# Altium schematic sheet TPS5420_SMPS.SchDoc
size A4
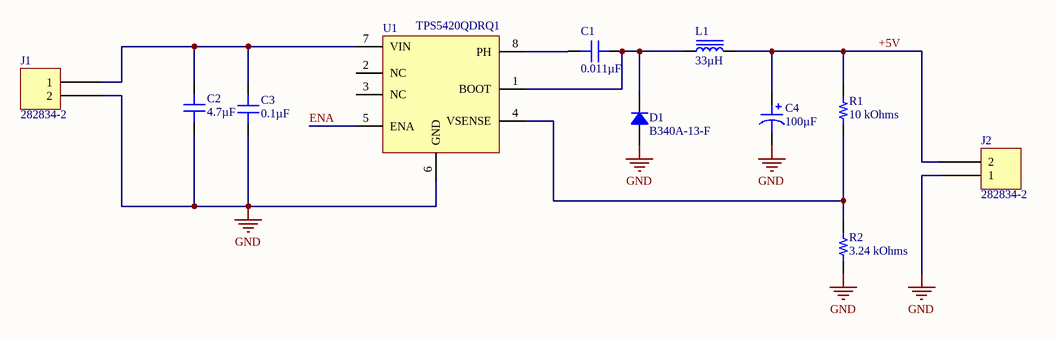
[diagram p0: TPS5420_SMPS.SchDoc]

## Parts
C1  0.011µF  [CAP 0805_2012]
C2  4.7µF  [CAP 0805_2012]
C3  0.1µF  [CAP 0805_2012]
C4  100µF  [CAP ALSMD 6.6MM H6.1MM]
D1  B340A-13-F  [DO214AC SMA]
J1  282834-2  [TE 282834-2]
J2  282834-2  [TE 282834-2]
L1  33µH  [BOURNS SRN8040]
R1  10 kOhms  [RES 0805_2012]
R2  3.24 kOhms  [RES 0805_2012]
U1  TPS5420QDRQ1  [SO8]

## Nets
GND: C2.1 C3.1 C4.2 D1.1 J1.2 J2.1 R2.1 U1.6(GND)
+5V: C4.1 J2.2 L1.2 R1.2
ENA: U1.5(ENA)
NetC1_1: C1.1 U1.8(PH)
NetC1_2: C1.2 D1.2 L1.1 U1.1(BOOT)
NetC2_2: C2.2 C3.2 J1.1 U1.7(VIN)
NetR1_1: R1.1 R2.2 U1.4(VSENSE)

Not connected (* = marked no-connect by the designer): U1 2(NC) 3(NC)

## Library data of the parts
C1 = GRM2195C1H113JA01D: CAP CER 0.011UF 50V C0G/NP0 0805; Manufacturer: Murata Electronics; Temperature Coefficient: C0G, NP0; Tolerance: ±5%; Part Number: GRM2195C1H113JA01D; Value: 0.011µF; Applications: General Purpose; Capacitance: 0.011µF; ComponentLink1Description: Datasheet; ComponentLink1URL: https://www.murata.com/~/media/webrenewal/support/library/catalog/products/capacitor/mlcc/c02e.ashx?la=en-us; ComponentLink2Description: DigiKey Link; ComponentLink2URL: http://digikey.com/product-detail/en/murata-electronics/GRM2195C1H113JA01D/490-8297-1-ND/4380591; Device Package: 0805 (2012 Metric); LastUpdated: 2.09.2020 01:04:18; Lifecycle Status: Active; Minimum Order: 1; Mounting Type: Surface Mount, MLCC; Operating Temperature: -55°C ~ 125°C; Package / Case: 0805 (2012 Metric); Packaging: TapeAndReel; PartId: 14729; Part Status: Active; Price: 0.09; Series: GRM; Size / Dimension: 0.079" L x 0.049" W (2.00mm x 1.25mm); Supplier 1: DigiKey; Supplier Part Number 1: 490-8297-1-ND; Thickness (Max): 0.037" (0.95mm); Voltage - Rated: 50V
C2 = C2012X5R1V475K125AC: CAP CER 4.7UF 35V X5R 0805; Manufacturer: TDK Corporation; Tolerance: ±10%; Part Number: C2012X5R1V475K125AC; Value: 4.7µF; Applications: General Purpose; Capacitance: 4.7µF; ComponentLink1Description: Datasheet; ComponentLink1URL: https://product.tdk.com/info/en/catalog/datasheets/mlcc_commercial_general_en.pdf?ref_disty=digikey; ComponentLink2Description: DigiKey Link; ComponentLink2URL: http://digikey.com/product-detail/en/tdk-corporation/C2012X5R1V475K125AC/445-14431-1-ND/3956097; Device Package: 0805 (2012 Metric); Features: Low ESL; LastUpdated: 2.09.2020 01:04:40; Lifecycle Status: Active; Minimum Order: 1; Mounting Type: Surface Mount, MLCC; Operating Temperature: -55°C ~ 85°C; Package / Case: 0805 (2012 Metric); Packaging: TapeAndReel; PartId: 3368; Part Status: Active; Price: 0.11; Series: C; Size / Dimension: 0.079" L x 0.049" W (2.00mm x 1.25mm); Supplier 1: DigiKey; Supplier Part Number 1: 445-14431-1-ND; Temperature Coefficient: X5R; Thickness (Max): 0.057" (1.45mm); Voltage - Rated: 35V
C3 = C0805C104M5RACAUTO: CAP CER 0.1UF 50V X7R 0805; Manufacturer: KEMET; Tolerance: ±20%; Part Number: C0805C104M5RACAUTO; Value: 0.1µF; Applications: Automotive, Bypass, Decoupling; Capacitance: 0.1µF; ComponentLink1Description: Datasheet; ComponentLink1URL: https://api.kemet.com/component-edge/download/datasheet/C0805C104M5RACAUTO.pdf; ComponentLink2Description: DigiKey Link; ComponentLink2URL: http://digikey.com/product-detail/en/kemet/C0805C104M5RACAUTO/399-12977-1-ND/5762259; Device Package: 0805 (2012 Metric); LastUpdated: 2.09.2020 01:04:42; Lifecycle Status: Active; Minimum Order: 1; Mounting Type: Surface Mount, MLCC; Operating Temperature: -55°C ~ 125°C; Package / Case: 0805 (2012 Metric); Packaging: TapeAndReel; PartId: 2568; Part Status: Active; Price: 0.02; Ratings: AEC-Q200; Series: SMD Auto X7R; Size / Dimension: 0.079" L x 0.049" W (2.00mm x 1.25mm); Supplier 1: DigiKey; Supplier Part Number 1: 399-12977-1-ND; Temperature Coefficient: X7R; Thickness (Max): 0.035" (0.88mm); Voltage - Rated: 50V
C4 = 107SML016M: CAP ALUM 100UF 20% 16V SMD; Manufacturer: Illinois Capacitor; ESR (Equivalent Series Resistance): 3.316Ohm @ 120Hz; Lifetime @ Temp.: 2000 Hrs @ 85°C; Polarization: Polar; Ripple Current @ High Frequency: 154.5mA @ 100kHz; Ripple Current @ Low Frequency: 103mA @ 120Hz; Surface Mount Land Size: 0.260" L x 0.260" W (6.60mm x 6.60mm); Part Number: 107SML016M; Applications: General Purpose; Capacitance: 100µF; ComponentLink1Description: Datasheet; ComponentLink1URL: http://www.illinoiscapacitor.com/pdf/seriesDocuments/SML%20series.pdf; ComponentLink2Description: DigiKey Link; ComponentLink2URL: http://digikey.com/product-detail/en/illinois-capacitor/107SML016M/1572-1307-1-ND/5974066; Device Package: Radial, Can - SMD; Height - Seated (Max): 0.217" (5.50mm); LastUpdated: 2.09.2020 01:18:40; Lifecycle Status: Active; Minimum Order: 1; Mounting Type: Surface Mount; Operating Temperature: -40°C ~ 85°C; Package / Case: Radial, Can - SMD; Packaging: TapeAndReel; PartId: 9069; Part Status: Active; Price: 0.09; Series: SML; Size / Dimension: 0.248" Dia (6.30mm); Supplier 1: DigiKey; Supplier Part Number 1: 1572-1307-1-ND; Tolerance: ±20%; Value: 100µF; Voltage - Rated: 16V
D1 = B340A-13-F: DIODE SCHOTTKY 40V 3A SMA; Manufacturer: Diodes Incorporated; Capacitance @ Vr, F: 200pF @ 4V, 1MHz; Current - Reverse Leakage @ Vr: 500µA @ 40V; Speed: Fast Recovery =< 500ns, > 200mA (Io); Voltage - Forward (Vf) (Max) @ If: 500mV @ 3A; Part Number: B340A-13-F; ComponentLink1Description: Datasheet; ComponentLink1URL: https://www.diodes.com/assets/Datasheets/ds30891.pdf; ComponentLink2Description: DigiKey Link; ComponentLink2URL: http://digikey.com/product-detail/en/diodes-incorporated/B340A-13-F/B340A-FDICT-ND/725054; Current - Average Rectified (Io): 3A; Diode Type: Schottky; LastUpdated: 2.09.2020 01:19:04; Lifecycle Status: Active; Minimum Order: 1; Mounting Type: Surface Mount; Operating Temperature - Junction: -55°C ~ 150°C; Package / Case: DO-214AC, SMA; Packaging: TapeAndReel; PartId: 1873; Part Status: Active; Price: 0.11; Series: Automotive, AEC-Q101; Supplier 1: DigiKey; Supplier Part Number 1: B340A-FDICT-ND; Supplier Device Package: SMA; Voltage - DC Reverse (Vr) (Max): 40V
J1 J2 = 282834-2: TERM BLK 2P SIDE ENT 2.54MM PCB; Manufacturer: TE Connectivity AMP Connectors; Current: 10A; Mating Orientation: Horizontal with Board; Number of Levels: 1; Pitch: 0.100" (2.54mm); Positions Per Level: 2; Voltage: 150V; Wire Gauge: 16-30 AWG; Wire Termination: Screw - Rising Cage Clamp; Part Number: 282834-2; Color: Green; ComponentLink1Description: Datasheet; ComponentLink1URL: https://www.te.com/commerce/DocumentDelivery/DDEController?Action=srchrtrv&DocNm=282834&DocType=Customer+Drawing&DocLang=English; ComponentLink2Description: DigiKey Link; ComponentLink2URL: http://digikey.com/product-detail/en/te-connectivity-amp-connectors/282834-2/A98333-ND/1150135; LastUpdated: 15.01.2020 04:15:38; Lifecycle Status: Active; Minimum Order: 1; Mounting Type: Through Hole; Packaging: Bulk; Part Status: Active; Price: 0.88; Series: Buchanan; Supplier 1: DigiKey; Supplier Part Number 1: A98333-ND
L1 = SRN8040-330M: FIXED IND 33UH 1.7A 145 MOHM SMD; Manufacturer: Bourns Inc.; Current - Saturation: 1.9A; DC Resistance (DCR): 145mOhm Max; Frequency - Self Resonant: 10MHz; Inductance Frequency - Test: 100kHz; Material - Core: Ferrite; Q @ Freq: 20 @ 2.52MHz; Shielding: Semi-Shielded; Tolerance: ±20%; Type: Wirewound; Part Number: SRN8040-330M; ComponentLink1Description: Datasheet; ComponentLink1URL: https://www.bourns.com/docs/Product-Datasheets/SRN8040.pdf; ComponentLink2Description: DigiKey Link; ComponentLink2URL: http://digikey.com/product-detail/en/bourns-inc/SRN8040-330M/SRN8040-330MCT-ND/2756183; Current Rating (Amps): 1.7A; Device Package: Nonstandard; Height - Seated (Max): 0.157" (4.00mm); Inductance: 33µH; LastUpdated: 2.09.2020 01:30:21; Lifecycle Status: Active; Minimum Order: 1; Mounting Type: Surface Mount; Operating Temperature: -40°C ~ 125°C; Package / Case: Nonstandard; Packaging: TapeAndReel; PartId: 3620; Part Status: Active; Price: 0.27; Series: SRN8040; Size / Dimension: 0.315" L x 0.315" W (8.00mm x 8.00mm); Supplier 1: DigiKey; Supplier Part Number 1: SRN8040-330MCT-ND; Value: 33µH
R1 = ERA-6AEB103V: RES 10K OHM 0.1% 1/8W 0805; Manufacturer: Panasonic Electronic Components; Power (Watts): 0.125W, 1/8W; Temperature Coefficient: ±25ppm/°C; Part Number: ERA-6AEB103V; Value: 10 kOhms; ComponentLink1Description: Datasheet; ComponentLink1URL: https://industrial.panasonic.com/cdbs/www-data/pdf/RDM0000/AOA0000C307.pdf; ComponentLink2Description: DigiKey Link; ComponentLink2URL: http://digikey.com/product-detail/en/panasonic-electronic-components/ERA-6AEB103V/P10KDACT-ND/1465971; Composition: Thin Film; Device Package: 0805 (2012 Metric); Features: Automotive AEC-Q200; Height - Seated (Max): 0.024" (0.60mm); LastUpdated: 2.09.2020 01:15:23; Lifecycle Status: Active; Minimum Order: 1; Number of Terminations: 2; Operating Temperature: -55°C ~ 155°C; Package / Case: 0805 (2012 Metric); Packaging: TapeAndReel; PartId: 28062; Part Status: Active; Price: 0.04; Ratings: AEC-Q200; Resistance: 10 kOhms; Series: ERA-6A; Size / Dimension: 0.079" L x 0.049" W (2.00mm x 1.25mm); Supplier 1: DigiKey; Supplier Part Number 1: P10KDACT-ND; Supplier Device Package: 0805; Tolerance: ±0.1%
R2 = TNPW08053K24BEEA: RES 3.24K OHM 0.1% 1/8W 0805; Manufacturer: Vishay Dale; Power (Watts): 0.2W, 1/5W; Temperature Coefficient: ±25ppm/°C; Part Number: TNPW08053K24BEEA; Value: 3.24 kOhms; ComponentLink1Description: Datasheet; ComponentLink1URL: http://www.vishay.com/docs/28758/tnpw_e3.pdf; ComponentLink2Description: DigiKey Link; ComponentLink2URL: http://digikey.com/product-detail/en/vishay-dale/TNPW08053K24BEEA/541-3212-1-ND/6532854; Composition: Thin Film; Device Package: 0805 (2012 Metric); Features: Anti-Sulfur, Automotive AEC-Q200, Moisture Resistant; Height - Seated (Max): 0.022" (0.55mm); LastUpdated: 2.09.2020 01:15:02; Lifecycle Status: Active; Minimum Order: 1; Number of Terminations: 2; Operating Temperature: -55°C ~ 155°C; Package / Case: 0805 (2012 Metric); Packaging: TapeAndReel; PartId: 37827; Part Status: Active; Price: 0.18; Ratings: AEC-Q200; Resistance: 3.24 kOhms; Series: TNPW e3; Size / Dimension: 0.079" L x 0.049" W (2.00mm x 1.25mm); Supplier 1: DigiKey; Supplier Part Number 1: 541-3212-1-ND; Supplier Device Package: 0805; Tolerance: ±0.1%
U1 = TPS5420QDRQ1: IC REG BUCK ADJUSTABLE 2A 8SOIC; Manufacturer: Texas Instruments; Supplier Link: https://www.digikey.com/en/products/detail/texas-instruments/TPS5420QDRQ1/1830706; Digi-Key Part Number: 296-23226-6-ND; Manufacturer Product Number: TPS5420QDRQ1